# EAGLE design display (EAGLE 6.1)
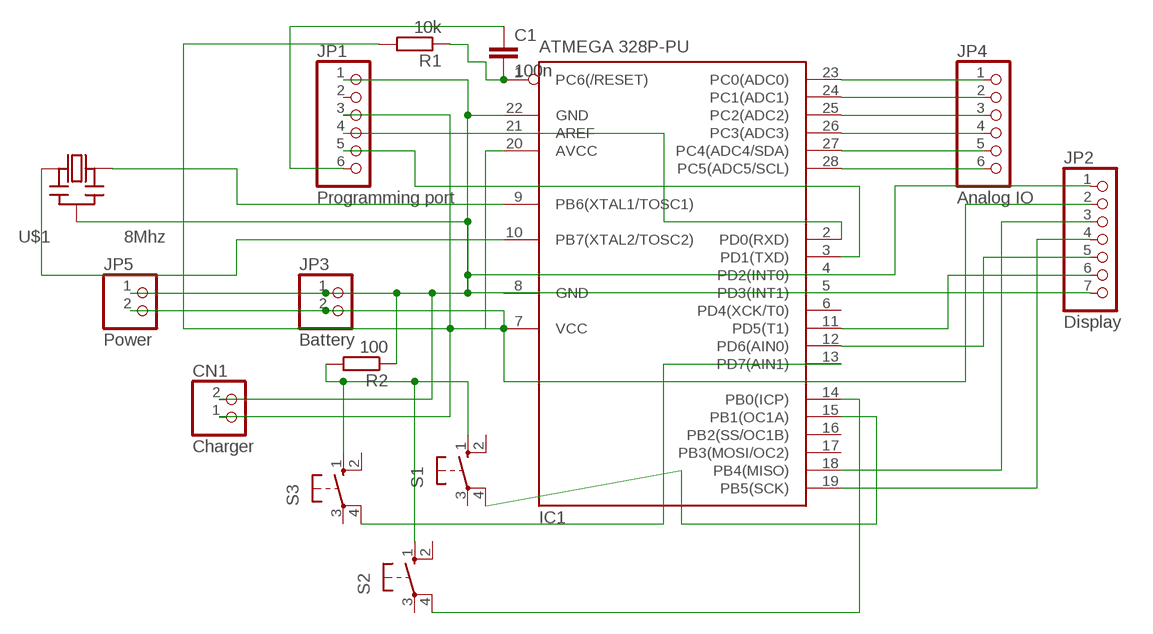
[diagram p0: schematic, sheet 1]

## Parts
C1  100n  C-EU050-025X075  [C050-025X075]
CN1  Charger  JST_2PIN-THM-RA  [JST-PH-2-THM-RA]
IC1  ATMEGA 328P-PU  MEGA8-P  [DIL28-3]
JP1  Programming port  PINHD-1X6/90  [1X06/90]
JP2  Display  PINHD-1X7  [1X07]
JP3  Battery  PINHD-1X2  [1X02]
JP4  Analog IO  PINHD-1X6CLEAN  [1X06-CLEAN]
JP5  Power  PINHD-1X2  [1X02]
R1  10k  R-EU_0204/7  [0204/7]
R2  100  R-EU_0204/7  [0204/7]
S1  10-XX  [B3F-10XX]
S2  10-XX  [B3F-10XX]
S3  10-XX  [B3F-10XX]
U$1  8Mhz  CERMOSCILL-THM  [CERM_OSC]

## Nets
N$1: IC1.23(PC0(ADC0)) JP4.1
N$2: IC1.10(PB7(XTAL2/TOSC2)) U$1.P$1(IN)
N$3: IC1.19(PB5(SCK)) JP2.4
N$4: C1.2 IC1.1(PC6(/RESET)) R1.1
N$5: IC1.2(PD0(RXD)) JP1.4
N$6: IC1.3(PD1(TXD)) JP1.5
N$7: IC1.18(PB4(MISO)) JP2.3
N$8: CN1.1 IC1.7(VCC) IC1.20(AVCC) JP1.3 JP2.2 JP3.2 JP5.2 R1.2
N$10: IC1.15(PB1(OC1A)) S1.4(P1)
N$11: IC1.13(PD7(AIN1)) S3.4(P1)
N$12: C1.1 JP1.6
N$13: R2.2 S1.1(S) S2.1(S) S3.1(S)
N$14: IC1.12(PD6(AIN0)) JP2.5
N$15: IC1.9(PB6(XTAL1/TOSC1)) U$1.P$3(OUT)
N$16: IC1.11(PD5(T1)) JP2.6
N$17: IC1.14(PB0(ICP)) S2.4(P1)
N$18: IC1.28(PC5(ADC5/SCL)) JP4.6
N$19: IC1.27(PC4(ADC4/SDA)) JP4.5
N$20: IC1.26(PC3(ADC3)) JP4.4
N$21: IC1.25(PC2(ADC2)) JP4.3
N$22: IC1.24(PC1(ADC1)) JP4.2
N$24: CN1.2 IC1.8(GND) IC1.22(GND) JP1.1 JP2.1 JP2.7 JP3.1 JP5.1 R2.1 U$1.P$2(GND)
Unconnected: IC1.4(PD2(INT0)) IC1.5(PD3(INT1)) IC1.6(PD4(XCK/T0)) IC1.16(PB2(SS/OC1B)) IC1.17(PB3(MOSI/OC2)) IC1.21(AREF) JP1.2 S1.2(S1) S1.3(P) S2.2(S1) S2.3(P) S3.2(S1) S3.3(P)

## Library data of the parts
C1 = resistor:C-EU: CAPACITOR, European symbol
CN1 = adafruit:JST_2PIN: JST 2-Pin Connectors of various flavors SMT-RA (S2B-PH-SM4) 4UConnector #17311 SMT (B2B-PH-SM4) THM-RA (S2B-PH) THM (B2B-PH)
IC1 = atmel:MEGA8-P: MICROCONTROLLER 8 Kbytes FLASH, 1 kbytes SRAM, 512 bytes EEPROM, USART, 4-channel 10 bit ADC, 2-channel 8 bit ADC Pin compatible with Atmega48, ATMega88, ATMega168 Source: avr.lbr; OC_FARNELL: unknown; OC_NEWARK: unknown
JP1 = pinhead:PINHD-1X6: PIN HEADER
JP2 = pinhead:PINHD-1X7: PIN HEADER
JP3 JP5 = pinhead:PINHD-1X2: PIN HEADER
JP4 = adafruit:PINHD-1X6: PIN HEADER
R1 R2 = rcl:R-EU_: RESISTOR, European symbol
S1-S3 = switch-omron:10-XX: OMRON SWITCH; MPN: B3F-1000; OC_FARNELL: 176432; OC_NEWARK: 36M3542
U$1 = adafruit:CERMOSCILL: Ceramic oscillator with built in capacitors such as ZTT-12MHz http://www.ladyada.net/library/eagle

## Board
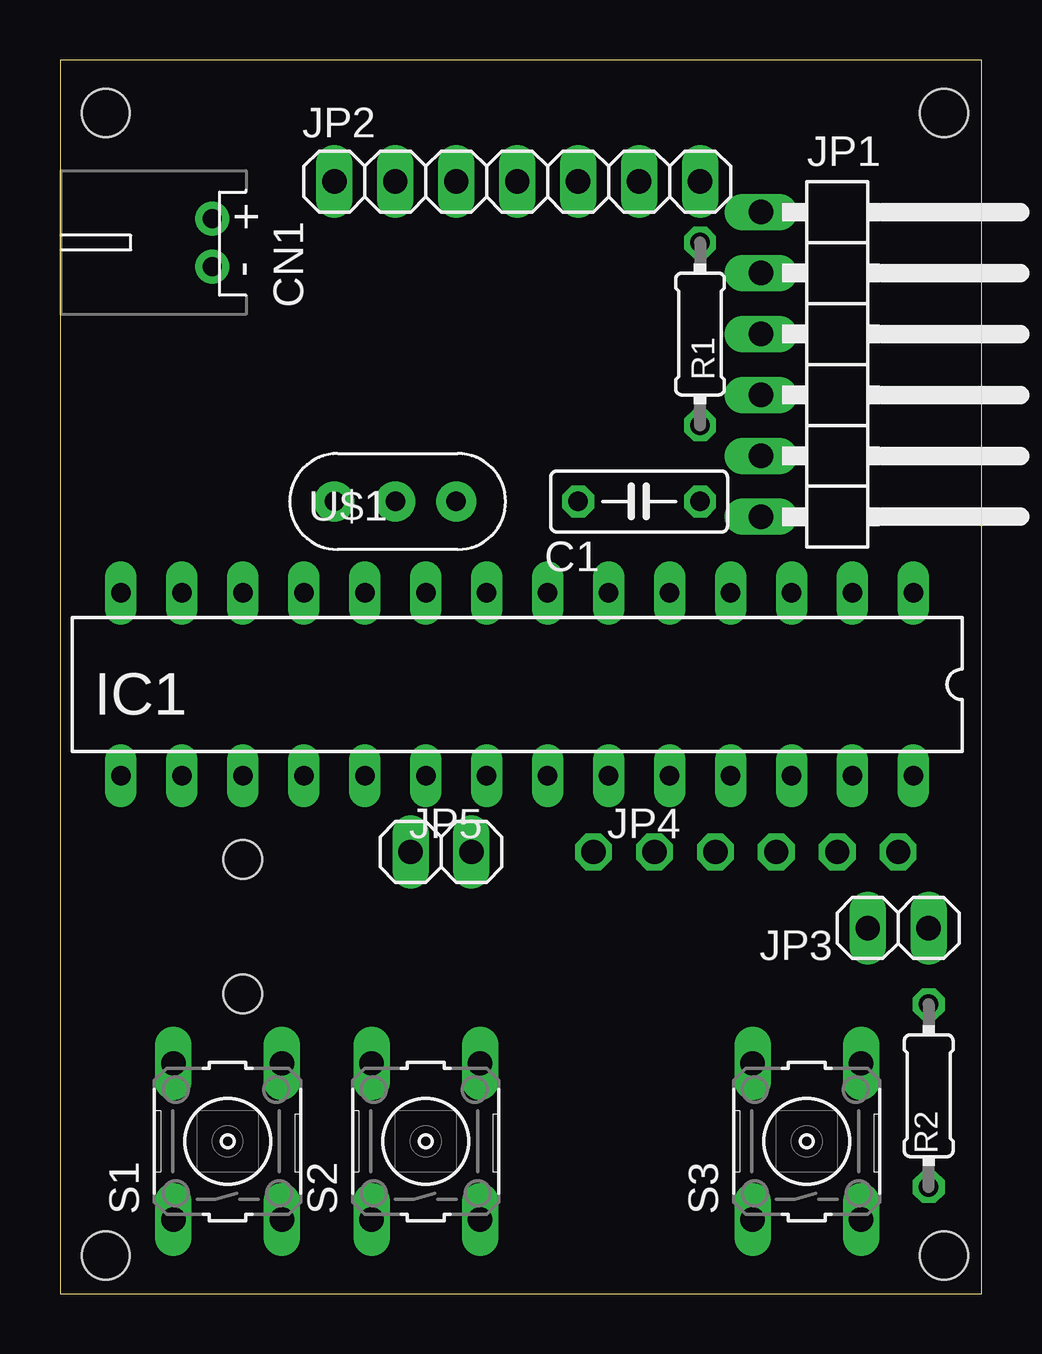
[diagram p1: board, top side]
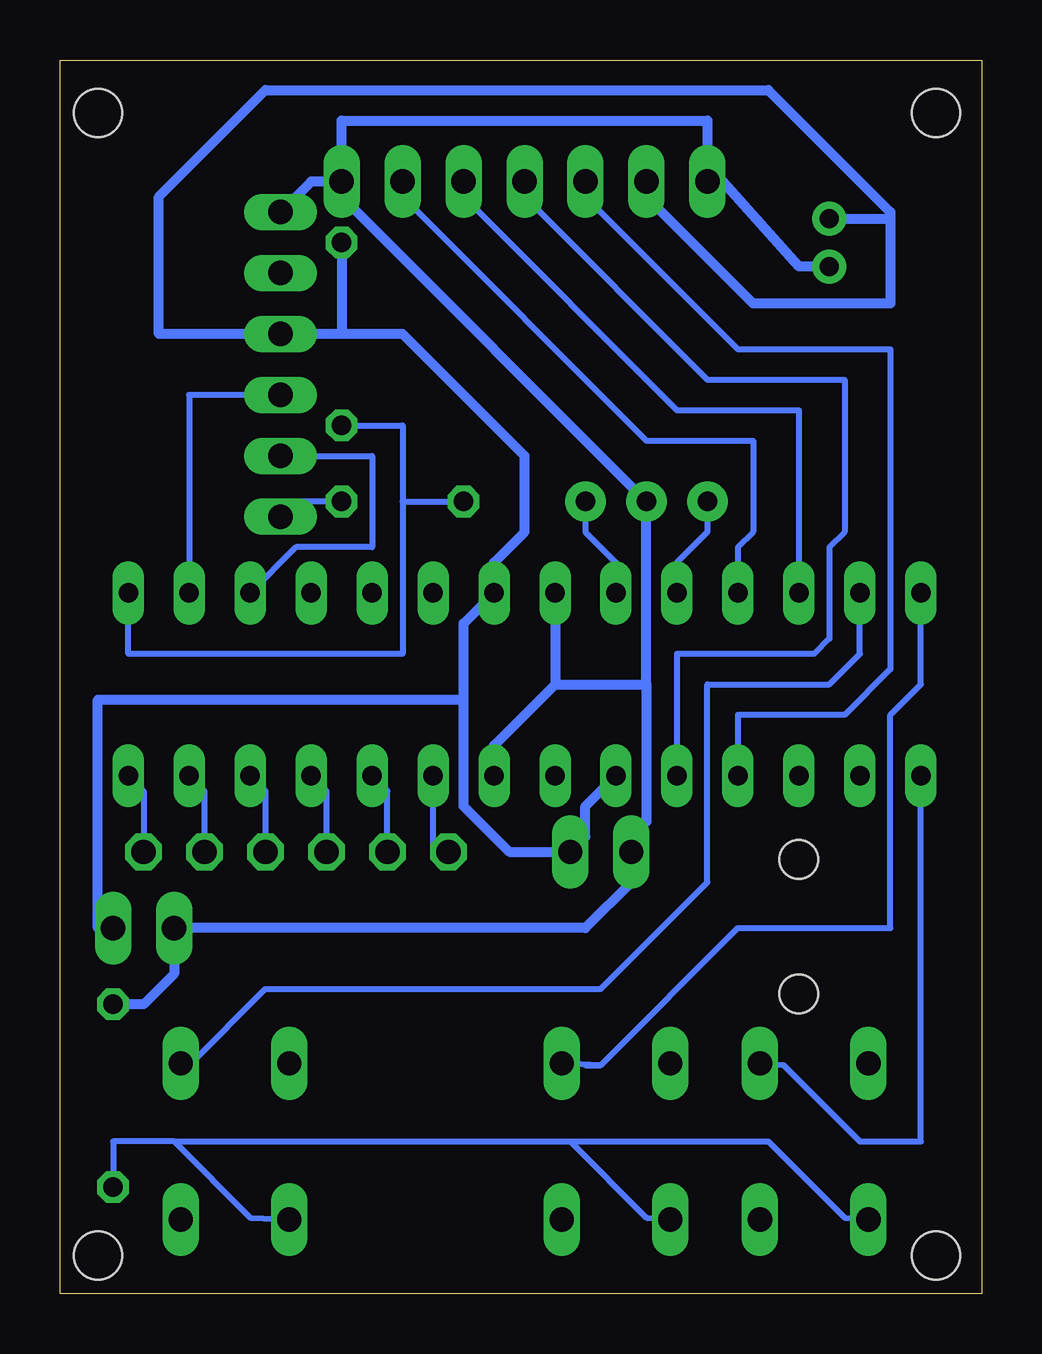
[diagram p2: board, bottom side, seen from below]

Size 38.41 x 51.42 mm. Coordinates in mm from the lower left corner, seen from the top.
Outline: 0,0 38.41,0 38.41,51.42 0,51.42 0,0
Copper layers (1*16): Top 0.035mm / dielectric 1.5mm / Bottom 0.035mm
Design rules: minimum track width 10mil, minimum drill 24mil, track to track 8mil, track to pad 8mil, pad to pad 8mil, via to via 8mil, smd to smd 8mil, copper to edge 40mil, drill to drill 8mil, minimum pad ring 10mil, minimum via ring 8mil, stop-mask expansion 4mil, vias tented up to drill 0mil, thermal gap 10mil
Holes 1.6 mm at 7.62,18.1 7.62,12.5
Holes 2 mm at 1.91,49.22 36.83,49.22 1.91,1.59 36.83,1.59

### Footprints (pad centres in the part's own frame; a part is rotated, then mirrored left to right if it is on the bottom)
C050-025X075 = drill 0.813 octagon: 1 -2.54,0; 2 2.54,0
JST-PH-2-THM-RA = drill 0.8 pad 1.422: 1 1,0; 2 -1,0
DIL28-3 = drill 0.813 long: 1 -16.51,-3.81; 2 -13.97,-3.81; 3 -11.43,-3.81; 4 -8.89,-3.81; 5 -6.35,-3.81; 6 -3.81,-3.81; 7 -1.27,-3.81; 8 1.27,-3.81; 9 3.81,-3.81; 10 6.35,-3.81; 11 8.89,-3.81; 12 11.43,-3.81; 13 13.97,-3.81; 14 16.51,-3.81; 15 16.51,3.81; 16 13.97,3.81; 17 11.43,3.81; 18 8.89,3.81; 19 6.35,3.81; 20 3.81,3.81; 21 1.27,3.81; 22 -1.27,3.81; 23 -3.81,3.81; 24 -6.35,3.81; 25 -8.89,3.81; 26 -11.43,3.81; 27 -13.97,3.81; 28 -16.51,3.81
1X06/90 = drill 1.016 long: 1 -6.35,-3.81; 2 -3.81,-3.81; 3 -1.27,-3.81; 4 1.27,-3.81; 5 3.81,-3.81; 6 6.35,-3.81
1X07 = drill 1.016 long: 1 -7.62,0; 2 -5.08,0; 3 -2.54,0; 4 0,0; 5 2.54,0; 6 5.08,0; 7 7.62,0
1X02 = drill 1.016 long: 1 -1.27,0; 2 1.27,0
1X06-CLEAN = drill 1.016 octagon: 1 -6.35,0; 2 -3.81,0; 3 -1.27,0; 4 1.27,0; 5 3.81,0; 6 6.35,0
0204/7 = drill 0.813 octagon: 1 -3.81,0; 2 3.81,0
B3F-10XX = drill 1.016 long: 1 -3.251,2.261; 2 3.251,2.261; 3 -3.251,-2.261; 4 3.251,-2.261
CERM_OSC = drill 0.813 pad 1.676: P$1 -2.54,0; P$2 0,0; P$3 2.54,0

### Placement (x,y rotation side)
C1  24.13,33.02 180 top
CN1  6.35,43.81 90 top
IC1  19.05,25.4 180 top
JP1  33.02,38.73 270 top
JP2  19.05,46.35 0 top
JP3  34.92,15.24 0 top
JP4  28.57,18.41 0 top
JP5  15.88,18.41 0 top
R1  26.67,40.01 90 top
R2  36.2,8.26 270 top
S1  6.99,6.35 90 top
S2  15.24,6.35 90 top
S3  31.11,6.35 90 top
U$1  13.97,33.02 0 top

### Tracks (layer width: path | path; a pad name or v marks a point on that pad's centre or on a via)
N$1
  Bottom 0.254: JP4.1 22.86,18.41 IC1.23
N$2
  Bottom 0.254: U$1.P$1 11.43,31.75 12.7,30.48 IC1.10
N$3
  Bottom 0.254: IC1.19 12.7,26.67 6.99,26.67 6.35,27.3 6.35,31.11 5.71,31.75 5.71,38.1 11.43,38.1 19.05,45.72 JP2.4
N$4
  Bottom 0.254: 24.13,33.02 24.13,26.67 35.56,26.67 IC1.1 | R1.1 24.13,36.2 24.13,33.02 | 24.13,33.02 C1.2
N$5
  Bottom 0.254: IC1.2 33.02,37.47 JP1.4
N$6
  Bottom 0.254: IC1.3 28.57,31.11 25.4,31.11 25.4,34.92 JP1.5
N$7
  Bottom 0.254: IC1.18 10.16,24.13 5.71,24.13 3.81,26.04 3.81,39.37 10.16,39.37 16.51,45.72 JP2.3
N$8
  Bottom 0.406: IC1.20 16.51,20.32 16.51,19.05 JP5.2 19.68,18.41 21.59,20.32 21.59,24.77 | JP3.2 36.83,15.24 36.83,24.77 21.59,24.77 | 21.59,24.77 21.59,27.94 IC1.7 20.32,30.48 19.05,31.75 19.05,34.92 24.13,40.01 26.67,40.01 | JP2.2 13.97,45.72 9.53,41.27 3.81,41.27 3.81,44.81 | R1.2 26.67,40.01 | 26.67,40.01 JP1.3 34.29,40.01 34.29,45.72 29.84,50.16 8.89,50.16 3.81,45.09 3.81,44.81 | CN1.1 3.81,44.81
N$10
  Bottom 0.254: IC1.15 2.54,6.35 5.08,6.35 8.26,9.53 S1.4
N$11
  Bottom 0.254: S3.4 33.02,9.6 33.02,9.53 29.84,12.7 15.88,12.7 11.43,17.14 11.43,25.4 6.35,25.4 5.08,26.67 IC1.13
N$12
  Bottom 0.254: C1.1 28.57,33.02 JP1.6
N$13
  Bottom 0.254: 17.14,6.35 13.97,3.17 S2.1 | 33.66,6.35 36.2,6.35 R2.2 | 33.66,6.35 30.48,3.17 S3.1 | 33.66,6.35 17.14,6.35 | 17.14,6.35 8.89,6.35 5.71,3.17 S1.1
N$14
  Bottom 0.254: IC1.12 7.62,36.83 12.7,36.83 21.59,45.72 JP2.5
N$15
  Bottom 0.254: U$1.P$3 16.51,31.75 15.24,30.48 IC1.9
N$16
  Bottom 0.254: IC1.11 10.16,31.11 9.53,31.75 9.53,35.56 13.97,35.56 24.13,45.72 JP2.6
N$17
  Bottom 0.254: IC1.14 2.54,25.4 3.81,24.13 3.81,15.24 10.16,15.24 15.88,9.53 | 16.51,9.53 15.88,9.53 | 15.88,9.53 S2.4
N$18
  Bottom 0.254: IC1.28 34.92,20.95 JP4.6
N$19
  Bottom 0.254: IC1.27 32.38,20.95 JP4.5
N$20
  Bottom 0.254: IC1.26 29.84,20.95 JP4.4
N$21
  Bottom 0.254: IC1.25 27.3,20.95 JP4.3
N$22
  Bottom 0.254: IC1.24 24.77,20.95 JP4.2
N$24
  Bottom 0.406: JP2.7 26.67,48.9 11.43,48.9 JP2.1 10.79,46.35 7.62,42.81 CN1.2 | JP2.7 27.94,46.35 JP1.1 | JP2.7 26.67,45.72 U$1.P$2 13.97,25.4 | R2.1 34.92,12.06 33.66,13.34 JP3.1 16.51,15.24 14.61,17.14 JP5.1 14.61,19.05 13.97,19.68 13.97,25.4 | 17.78,25.4 20.32,22.86 IC1.22 | IC1.8 17.78,25.4 | 17.78,25.4 13.97,25.4